# EasyEDA Pro project ProPrj_NavBot-ES02.epro, board CODER
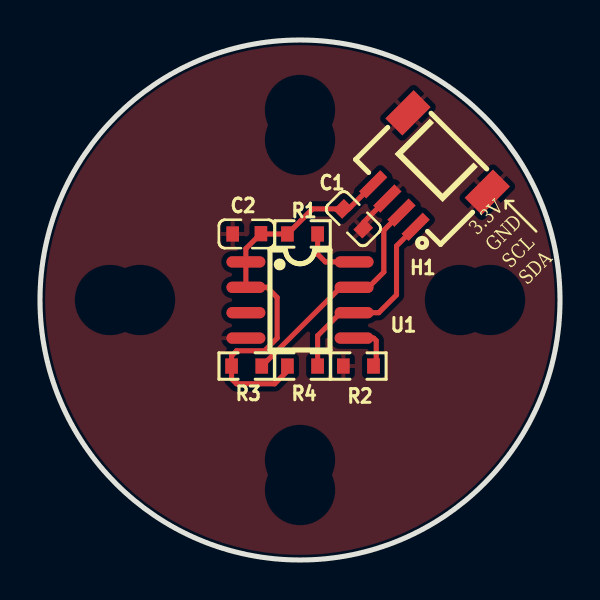
[diagram p5: board, top side]
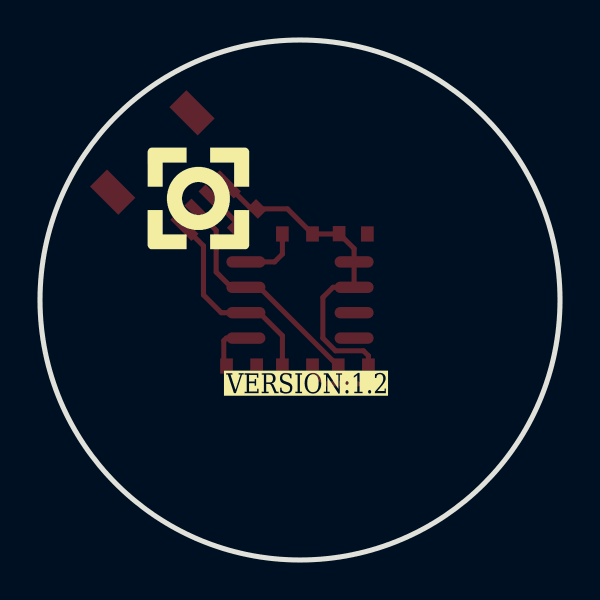
[diagram p6: board, bottom side, seen from below]

Outline 26 x 26 mm; copper layers: Top Layer, Bottom Layer. Coordinates in mm from the lower left corner of the outline.
Outline path: circle c13,13 r13
Stack: Top Layer 0.035mm / Dielectric1 1.51mm FR4 er 4.5 / Bottom Layer 0.035mm

## Design rules (mm)
spacing copperThickness1oz (default): track to track 0.102, other pairs 0 to 0.3
spacing copperThickness2oz: track to track 0.203, other pairs 0.152 to 0.3
spacing Plane_innerPlane: track to track 0.102, other pairs 0 to 0.3
spacing Copper_copperRegion: track to track 0.102, other pairs 0 to 0.3
track width copperThickness1oz (default): min 0.127, default 0.254, max 2.54
track width copperThickness2oz: min 0.203, default 0.254, max 2.54
differential pair differentialPair (default): width min 0.127, default 0.254, max 2.54; gap min 0.152, default 0.152
pour e56 uses Copper_copperRegion

## Placement (name value [footprint] x y rotation side)
C1  10uF  [C0603]  15.67 17.06 135 top
C2  100nF  [C0603]  10.33 16.3 0 top
H1  1.0-4PWB  [CONN-SMD_4P-P1.00_DEALON_1.0-4PWB]  19 19 135 top
R1  100kΩ  [R0603]  13.13 16.3 180 top
R2  1kΩ  [R0603]  15.92 9.7 0 top
R3  10kΩ  [R0603]  10.33 9.7 180 top
R4  10kΩ  [R0603]  13.13 9.7 180 top
U1  AS5600-ASOM  [SOIC-8_L5.0-W4.0-P1.27-LS6.0-BL]  13 13 270 top

## Footprints (pads in the part's own frame, mm; a bottom-side part is the same pattern mirrored in y, then rotated)
C0603
  rect 0.635x0.762 smd: 1(-0.7,0) 2(0.711,0.016)
CONN-SMD_4P-P1.00_DEALON_1.0-4PWB
  rect 0.5x1.5 smd: 1(-1.5,1.81) 2(-0.5,1.81) 3(0.5,1.81) 4(1.5,1.81)
  rect 1.2x2 smd: 5(2.8,-1.95) 6(-2.81,-1.95)
R0603
  rect 0.635x0.762 smd: 1(-0.753,0) 2(0.753,0)
SOIC-8_L5.0-W4.0-P1.27-LS6.0-BL
  oval 0.569x1.95 smd: 1(-1.905,-2.705) 2(-0.635,-2.705) 3(0.635,-2.705) 4(1.905,-2.705) 5(1.905,2.705) 6(0.635,2.705) 7(-0.635,2.705) 8(-1.905,2.705)

## Nets
As in the schematic.

Pads without a net: U1 3

## Routing (per net, layer and track width the routed paths; a pad name or vN(x,y) marks a point on that pad's centre or on a via; arc(x,y) is an arc through that point)
3.3V: length 20.7
  Top Layer w0.254: H1.4 15.43,17.56 C1.2 13.63,17.56 R1.2 11.06,16.3 C2.2 10.29,15.57 U1.1 U1.2 11.35,13.64 11.86,13.13 11.86,11.09 11.22,10.46 9.82,10.46 9.58,10.21 R3.2 9.58,9.05 9.82,8.81 11.73,8.81 12.37,9.45 R4.2
GND: length 2
  Top Layer w0.254: H1.3 16.16,16.87 16.16,16.57
SCL: length 11.4
  Top Layer w0.254: R3.1 11.09,9.7 15.03,13.64 U1.7 16.43,13.64 17.19,14.4 17.19,16.48 H1.2
SDA: length 10.1
  Top Layer w0.254: H1.1 17.83,15.7 17.83,13.25 16.94,12.36 U1.6 15.03,12.36 13.88,11.21 R4.1
$1N478: length 3
  Top Layer w0.254: U1.8 14.27,14.91 13.88,15.29 R1.1
$1N587: length 2.5
  Top Layer w0.254: R2.2 16.81,9.83 16.81,10.97 16.68,11.09 U1.5

## Copper pours and planes (outline as drawn; the poured copper is in the pictures)
GND on Top Layer: -2.62,27.61 25.19,27.61 28.24,24.56 28.24,4.36 21.25,-2.62 2.97,-2.62 -2.75,3.09 -2.75,27.48

## Text on the board
Bottom Silkscreen Layer: VERSION:1.2
Top Silkscreen Layer: 3.3V / GND / SCL / SDA
